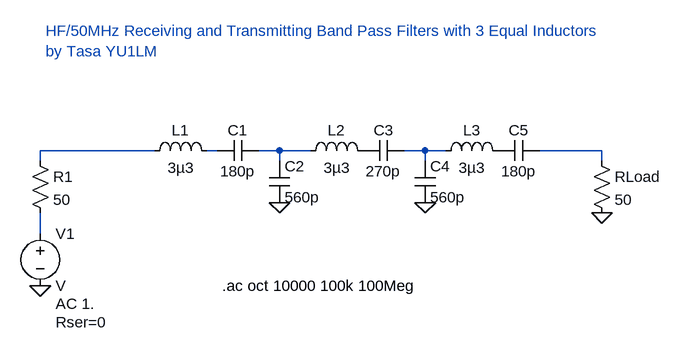
[diagram p0: schematic BPF-7Mhz.asc]
BPF-7Mhz.asc, the LTspice schematic file:
Version 4
SHEET 1 880 680
WIRE -144 96 -320 96
WIRE -48 96 -64 96
WIRE 48 96 16 96
WIRE 96 96 48 96
WIRE 272 96 240 96
WIRE 304 96 272 96
WIRE 544 96 448 96
WIRE -320 112 -320 96
WIRE 48 112 48 96
WIRE 272 112 272 96
WIRE 544 112 544 96
WIRE -320 224 -320 192
FLAG 48 176 0
FLAG 272 176 0
FLAG 544 192 0
FLAG -320 304 0
SYMBOL cap 16 80 R90
WINDOW 0 0 32 VBottom 2
WINDOW 3 32 32 VTop 2
SYMATTR InstName C1
SYMATTR Value 180p
SYMATTR SpiceLine ""
SYMBOL cap 32 112 R0
SYMATTR InstName C2
SYMATTR Value 560p
SYMATTR SpiceLine ""
SYMBOL cap 240 80 R90
WINDOW 0 0 32 VBottom 2
WINDOW 3 32 32 VTop 2
SYMATTR InstName C3
SYMATTR Value 270p
SYMATTR SpiceLine ""
SYMBOL cap 256 112 R0
SYMATTR InstName C4
SYMATTR Value 560p
SYMATTR SpiceLine ""
SYMBOL cap 448 80 R90
WINDOW 0 0 32 VBottom 2
WINDOW 3 32 32 VTop 2
SYMATTR InstName C5
SYMATTR Value 180p
SYMATTR SpiceLine ""
SYMBOL ind -160 112 R270
WINDOW 0 32 56 VTop 2
WINDOW 3 5 56 VBottom 2
SYMATTR InstName L1
SYMATTR Value 3µ3
SYMATTR SpiceLine ""
SYMBOL ind 80 112 R270
WINDOW 0 32 56 VTop 2
WINDOW 3 5 56 VBottom 2
SYMATTR InstName L2
SYMATTR Value 3µ3
SYMATTR SpiceLine ""
SYMBOL ind 288 112 R270
WINDOW 0 32 56 VTop 2
WINDOW 3 5 56 VBottom 2
SYMATTR InstName L3
SYMATTR Value 3µ3
SYMATTR SpiceLine ""
SYMBOL res 528 96 R0
SYMATTR InstName RLoad
SYMATTR Value 50
SYMATTR SpiceLine ""
SYMBOL voltage -320 208 R0
WINDOW 123 24 124 Left 2
WINDOW 39 24 152 Left 2
SYMATTR InstName V1
SYMATTR Value2 AC 1.
SYMATTR SpiceLine Rser=0
SYMBOL res -336 96 R0
SYMATTR InstName R1
SYMATTR Value 50
SYMATTR SpiceLine ""
TEXT -40 304 Left 2 !.ac oct 10000 100k 100Meg
TEXT -312 -88 Left 2 ;HF/50MHz Receiving and Transmitting Band Pass Filters with 3 Equal Inductors \nby Tasa YU1LM

The netlist it stands for:
* BPF-7Mhz.asc
C1 N003 N002 180p
C2 N003 0 560p
C3 N004 P001 270p
C4 N004 0 560p
C5 N005 P002 180p
L1 N001 N002 3µ3
L2 N003 P001 3µ3
L3 N004 P002 3µ3
RLoad N005 0 50
V1 N006 0 V AC 1. Rser=0
R1 N001 N006 50
.ac oct 10000 100k 100Meg
* HF/50MHz Receiving and Transmitting Band Pass Filters with 3 Equal Inductors
* by Tasa YU1LM
.backanno
.end